# Altium schematic sheet TDisplay.SchDoc: LiveDesign Evaluation - Countdown
size A4; Organization: Altium Limited; Address1: L3, 12a Rodborough Rd; Address2: Frenchs Forest; Address3: NSW; Address4: Australia 2086; DocumentNumber: 5; SheetNumber: 5; SheetTotal: 11
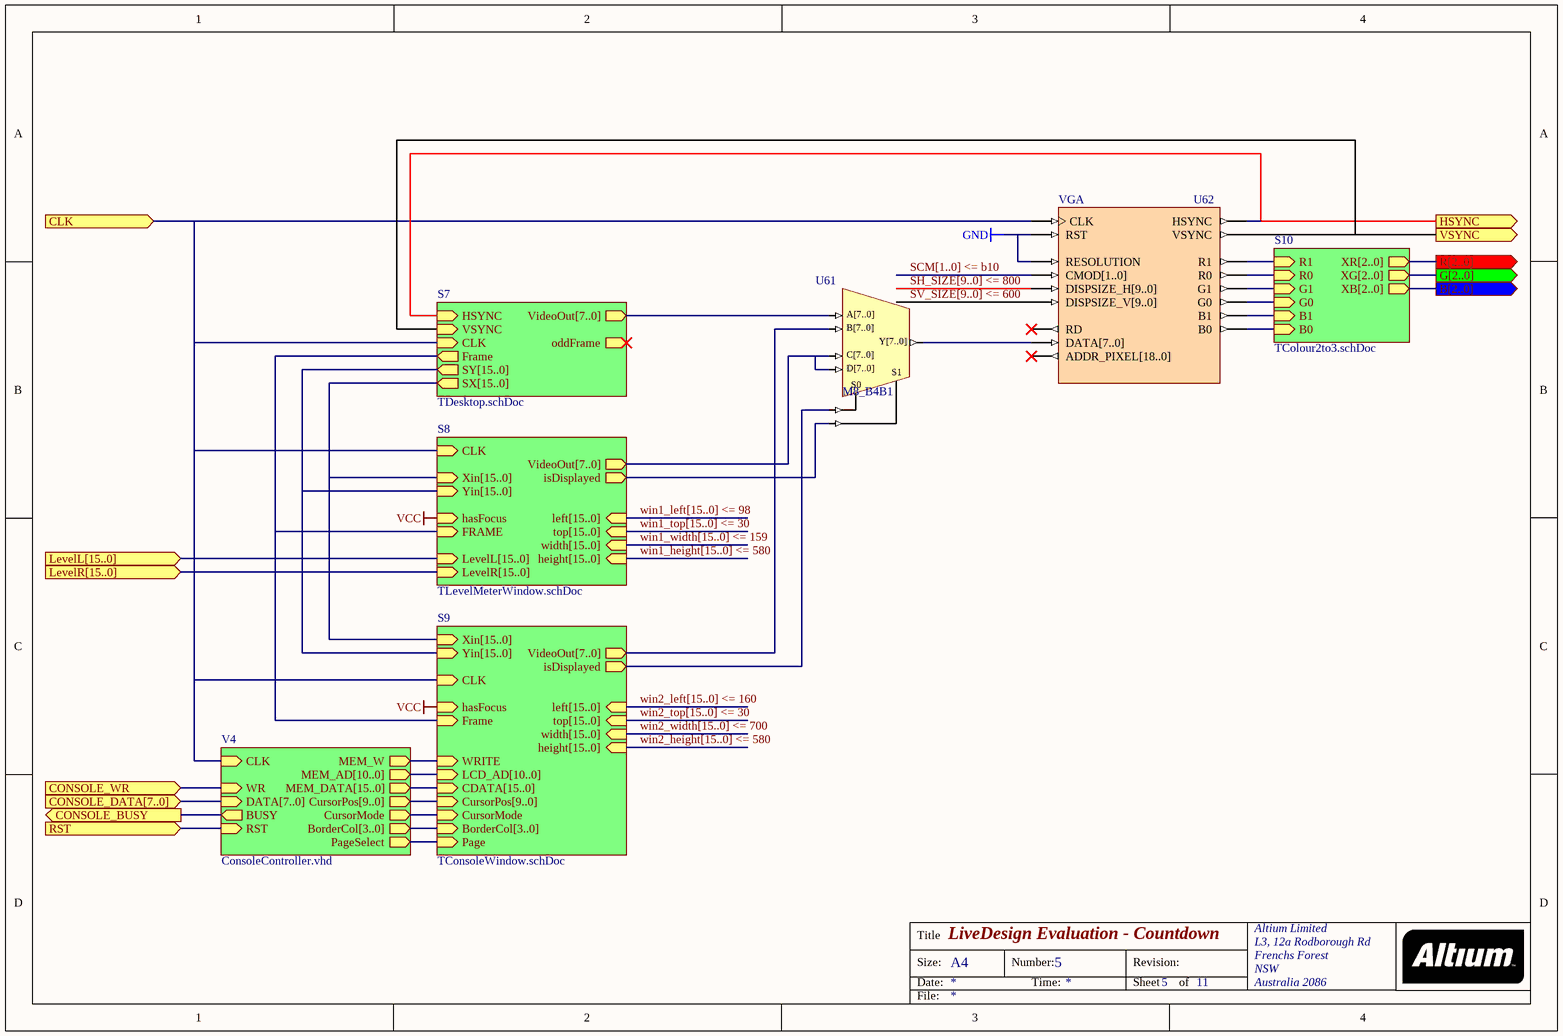
[diagram p0: TDisplay.SchDoc]

## Parts
U61  M8_B4B1
U62  VGA

## Sub-sheets
S7 = TDesktop.schDoc: CLK (in), VideoOut[7..0] (out), SX[15..0] (out), SY[15..0] (out), HSYNC (in), VSYNC (in), Frame (out), oddFrame (out)
S8 = TLevelMeterWindow.schDoc: CLK (in), VideoOut[7..0] (out), Xin[15..0] (in), Yin[15..0] (in), top[15..0] (in), width[15..0] (in), height[15..0] (in), left[15..0] (in), isDisplayed (out), hasFocus (in), LevelL[15..0] (in), LevelR[15..0] (in), FRAME (in)
S9 = TConsoleWindow.schDoc: CLK (in), VideoOut[7..0] (out), Xin[15..0] (in), Yin[15..0] (in), top[15..0] (in), width[15..0] (in), height[15..0] (in), left[15..0] (in), isDisplayed (out), hasFocus (in), WRITE (in), LCD_AD[10..0] (in), CDATA[15..0] (in), CursorPos[9..0] (in), Frame (in), CursorMode (in), BorderCol[3..0] (in), Page (in)
S10 = TColour2to3.schDoc: XR[2..0] (out), XG[2..0] (out), XB[2..0] (out), R1 (in), R0 (in), G1 (in), G0 (in), B1 (in), B0 (in)
V4 = ConsoleController.vhd: WR (in), DATA[7..0] (in), MEM_W (out), MEM_AD[10..0] (out), MEM_DATA[15..0] (out), CLK (in), CursorPos[9..0] (out), CursorMode (out), BUSY (out), RST (in), BorderCol[3..0] (out), PageSelect (out)

## Ports
B[2..0] (out), CLK (in), CONSOLE_BUSY (out), CONSOLE_DATA[7..0] (in), CONSOLE_WR (in), G[2..0] (out), HSYNC (out), LevelL[15..0] (in), LevelR[15..0] (in), R[2..0] (out), RST (in), VSYNC (out)

## Nets
GND: U62.RESOLUTION U62.RST
VCC: sheet S9/hasFocus, sheet S8/hasFocus
CLK: U62.CLK ; port CLK, sheet S7/CLK, sheet S9/CLK, sheet V4/CLK, sheet S8/CLK
CONSOLE_BUSY: port CONSOLE_BUSY, sheet V4/BUSY
CONSOLE_WR: port CONSOLE_WR, sheet V4/WR
HSYNC: U62.HSYNC ; port HSYNC, sheet S7/HSYNC
RST: port RST, sheet V4/RST
SCM[1..0] <= b10: U62.CMOD[1..0]
SH_SIZE[9..0] <= 800: U62.DISPSIZE_H[9..0]
SV_SIZE[9..0] <= 600: U62.DISPSIZE_V[9..0]
VSYNC: U62.VSYNC ; port VSYNC, sheet S7/VSYNC
NetU61_A[7..0]: U61.A[7..0] ; sheet S7/VideoOut[7..0]
NetU61_B[7..0]: U61.B[7..0] ; sheet S9/VideoOut[7..0]
NetU61_C[7..0]: U61.C[7..0] U61.D[7..0] ; sheet S8/VideoOut[7..0]
NetU61_S0: U61.S0 ; sheet S9/isDisplayed
NetU61_S1: U61.S1 ; sheet S8/isDisplayed
NetU61_Y[7..0]: U61.Y[7..0] U62.DATA[7..0]
NetU62_B0: U62.B0 ; sheet S10/B0
NetU62_B1: U62.B1 ; sheet S10/B1
NetU62_G0: U62.G0 ; sheet S10/G0
NetU62_G1: U62.G1 ; sheet S10/G1
NetU62_R0: U62.R0 ; sheet S10/R0
NetU62_R1: U62.R1 ; sheet S10/R1
(unnamed): sheet S7/Frame, sheet S9/Frame, sheet S8/FRAME
(unnamed): sheet S9/WRITE, sheet V4/MEM_W
(unnamed): sheet S9/CursorMode, sheet V4/CursorMode
(unnamed): sheet S9/Page, sheet V4/PageSelect

Not connected (* = marked no-connect by the designer): U62 ADDR_PIXEL[18..0]* RD*

## Buses and harness runs
bus port B[2..0] = sheet S10/XB[2..0]
bus port CONSOLE_DATA[7..0] = sheet V4/DATA[7..0]
bus port G[2..0] = sheet S10/XG[2..0]
bus port LevelL[15..0] = sheet S8/LevelL[15..0]
bus port LevelR[15..0] = sheet S8/LevelR[15..0]
bus port R[2..0] = sheet S10/XR[2..0]
bus SCM[1..0] <= b10
bus SH_SIZE[9..0] <= 800
bus sheet S7/SX[15..0] = sheet S8/Xin[15..0] = sheet S9/Xin[15..0]
bus sheet S7/SY[15..0] = sheet S8/Yin[15..0] = sheet S9/Yin[15..0]
bus sheet S9/BorderCol[3..0] = sheet V4/BorderCol[3..0]
bus sheet S9/CDATA[15..0] = sheet V4/MEM_DATA[15..0]
bus sheet S9/CursorPos[9..0] = sheet V4/CursorPos[9..0]
bus sheet S9/LCD_AD[10..0] = sheet V4/MEM_AD[10..0]
bus SV_SIZE[9..0] <= 600
bus win1_height[15..0] <= 580 = sheet S8/height[15..0]
bus win1_left[15..0] <= 98 = sheet S8/left[15..0]
bus win1_top[15..0] <= 30 = sheet S8/top[15..0]
bus win1_width[15..0] <= 159 = sheet S8/width[15..0]
bus win2_height[15..0] <= 580 = sheet S9/height[15..0]
bus win2_left[15..0] <= 160 = sheet S9/left[15..0]
bus win2_top[15..0] <= 30 = sheet S9/top[15..0]
bus win2_width[15..0] <= 700 = sheet S9/width[15..0]

## Notes on the sheet
- Title
- Size:
- Date:
- A4
- Number:
- Time:
- Revision:
- Sheet
- of
- File:

## Library data of the parts
U61 = M8_B4B1: 4x8-Bit Bus to 1x8-Bit Bus Multiplexer; ArchiveName: GENERIC; VHDLIB_SIM: GENERIC_LIB; SubClass: BnB1; PortSize: 8; PortStyle: Bus Version; Published: 29-Jan-2004; Publisher: Altium Limited; LastRevisionNo: 1.00.00; HelpURL: CR0118 FPGA Generic Library Guide.pdf#page=364; FunctionalClass: Multiplexer
U62 = VGA: VGA Controller; Published: 20/10/2003; Publisher: Altium Hobart Technology Centre; Core Revision: 1.00.00